# Altium schematic sheet Схема модуля АЦП.SchDoc
size 420 x 297 mm; Address1: Address1; Address2: Address2; Address3: Address3; Address4: Address4; DocumentNumber: АБВГ.123456.001 Э3; SheetNumber: 1; Scale: 1:1; DocumentType: Схема электрическая принципиальная; FirstReferrence: АБВГ.123456.001
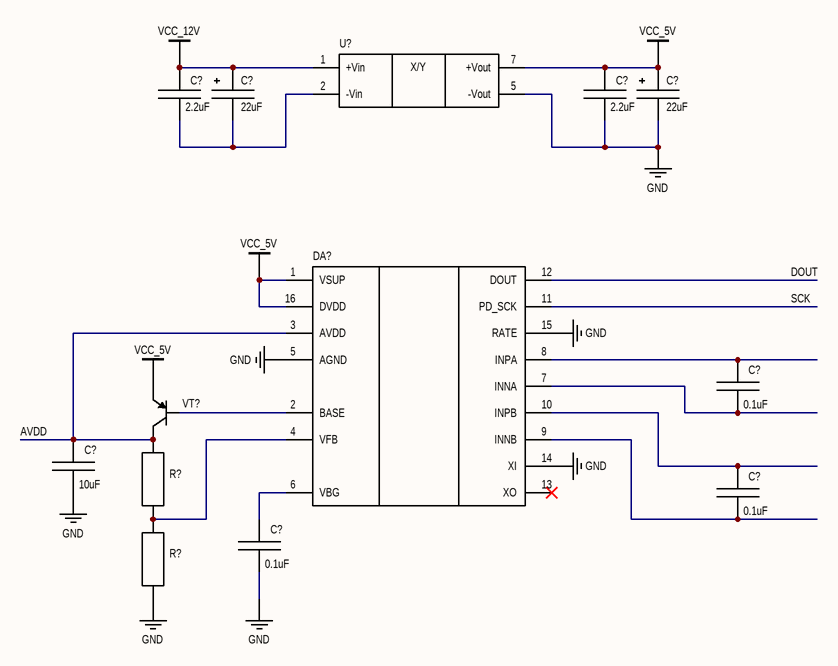
[diagram p0: Схема модуля АЦП.SchDoc]

## Parts
(Parts that share a designator on the sheet are numbered #1, #2 ... from top to bottom, then left to right.)
C?#1  2.2uF  [CH0201C]
C?#2  22uF  [D4C5.1H6]
C?#3  2.2uF  [CH0201C]
C?#4  22uF  [D4C5.1H6]
C?#5  0.1uF  [CH0805C]
C?#6  10uF  [CH1206C]
C?#7  0.1uF  [CH0805C]
C?#8  0.1uF  [CH0805C]
DA?  HX711  [16-SOP]  (value not drawn)
R?#1  *  [CH0603R]  (value not drawn)
R?#2  *  [CH0603R]  (value not drawn)
U?  TMV 1205S  [TMV-1205S]  (value not drawn)
VT?  MMSS8550-L-TP  [SOT23_132]  (value not drawn)

## Nets
GND: C?#3.2 C?#4.2 C?#6.2 C?#8.2 DA?.5(AGND) DA?.14(XI) DA?.15(RATE) R?#2.1 U?.5(-Vout)
VCC_5V: C?#3.1 C?#4.1 DA?.1(VSUP) DA?.16(DVDD) U?.7(+Vout) VT?.2(E)
VCC_12V: C?#1.1 C?#2.1 U?.1(+Vin)
AVDD: C?#6.1 DA?.3(AVDD) R?#1.2 VT?.3(C)
DOUT: DA?.12(DOUT)
SCK: DA?.11(PD_SCK)
NetC?#1_2: C?#1.2 C?#2.2 U?.2(-Vin)
NetC?#5_1: C?#5.1 DA?.8(INPA)
NetC?#5_2: C?#5.2 DA?.7(INNA)
NetC?#7_1: C?#7.1 DA?.10(INPB)
NetC?#7_2: C?#7.2 DA?.9(INNB)
NetC?#8_1: C?#8.1 DA?.6(VBG)
NetDA?_2: DA?.2(BASE) VT?.1(B)
NetDA?_4: DA?.4(VFB) R?#1.1 R?#2.2

Not connected (* = marked no-connect by the designer): DA? 13(XO)*

## Notes on the sheet
- Подп. и дата
- Инв. № дубл.
- Взам. инв. №
- Инв. № подл.
- Изм.
- Лист
- № докум.
- Подп.
- Дата
- 2.106-A3
- Копировал
- Формат А3
- (in symbol TMV 1205S) X/Y

## Library data of the parts
C?#1 C?#3 = Capacitor: Manufacturer: Samsung Electro-Mechanics; Model: CL31B225KOHNNNE; HelpURL: https://www.digikey.com/en/products/detail/samsung-electro-mechanics/CL31B225KOHNNNE/3886922; ComponentKind: 1206 (3216 Metric); Value: 2.2uF; Supplier 1: Avnet; Supplier Part Number 1: CL31B225KOHNNNE
C?#2 C?#4 = AlumCap: Cap Aluminum Lytic 22uF 25V 20% (5 X 11mm) Radial 2mm 60mA 2000h 105C Bulk; Manufacturer: KEMET; Model: ESH226M025AC3AA; Dielectric Material: Aluminium; Leakage Current: 5.5uA; Life (Hours): 2000Hour; Dissipation Factor: 16%; Lead Diameter: 0.5mm; Lead Length: 20mm; HelpURL: https://www.digikey.com/en/products/detail/kemet/ESH226M025AC3AA/3082977; ComponentKind: *; Value: 22uF; Supplier 1: Digi-Key; Supplier Part Number 1: 399-6562-ND; Manufacturer Part Number: ESH226M025AC3AA; RoHS: Yes; Category: Aluminum Electrolytic Capacitors; Stock: 47373; Pricing: 1=0,20000, 10=0,13600, 50=0,08180, 100=0,06900, 500=0,04724, 1000=0,04179, 2500=0,03998, 5000=0,03634 (USD); Mount: Through Hole,PCB; Case/Package: Radial; Min Operating Temperature: -40°C; Max Operating Temperature: 105°C; Capacitance: 22uF; Tolerance: 20%; Ripple Current: 60mA; Termination: Radial; Voltage Rating (DC): 25V; Voltage Rating: 25V; Package Quantity: 10000; Packaging: Bulk; Voltage: 25V; Series: ESH; Diameter: 5mm; Length: 11mm; Height: 11mm; Lead Pitch: 2mm; Height - Seated (Max): 0.492inch; Radiation Hardening: No; REACH SVHC: No SVHC; RoHS Compliant: Yes; ComponentLink1URL: https://datasheet.ciiva.com/22627/1794402-22627018.pdf?src-supplier=Farnell; ComponentLink1Description: https://datasheet.ciiva.com/22627/1794402-22627018.pdf?src-supplier=Farnell
C?#5 C?#7 C?#8 = Capacitor: Surface Mount Ceramic Multilayer Capacitor 0.1uF 5% X7R 16V 0805 Paper T/R; Manufacturer: YAGEO; Model: CC0805JRX7R7BB104; Capacitance: 100nF; HelpURL: https://www.digikey.com/en/products/detail/yageo/CC0805JRX7R7BB104/5884101; ComponentKind: 0805 (2012 Metric); Value: 0.1uF; Supplier 1: Digi-Key; Supplier Part Number 1: 311-4266-1-ND; Manufacturer Part Number: CC0805JRX7R7BB104; RoHS: Yes; Category: Ceramic Capacitors; Stock: 24921; Pricing: 1=0,12000, 10=0,08400, 50=0,04760, 100=0,03950, 500=0,02768, 1000=0,02291 (USD); Mount: Surface Mount; Case/Package: 0805; Case Code (Imperial): 0805; Case Code (Metric): 2012; Weight: 0.000194oz; Min Operating Temperature: -55°C; Max Operating Temperature: 125°C; Tolerance: 5%; Packaging: Tape and Reel; Voltage Rating (DC): 16V; Voltage Rating: 16V; Dielectric: X7R; Termination: SMD/SMT; Resistor Type: Ceramic; Series: CC; Length: 2mm; Width: 0.049inch; Thickness: 0.037inch; Depth: 1.25mm; Radiation Hardening: No; Lead Free: Lead Free; Halogen Free: Halogen Free; RoHS Compliant: Yes; ComponentLink1URL: https://datasheet.ciiva.com/26918/getdatasheetpartid-755584-26918332.pdf?src-supplier=Verical; ComponentLink1Description: https://datasheet.ciiva.com/26918/getdatasheetpartid-755584-26918332.pdf?src-supplier=Verical
C?#6 = Capacitor: Cap Ceramic 10uF 16V X7R 20% SMD 1206 125°C Embossed T/R; Manufacturer: Samsung Electro-Mechanics; Model: CL31B106MOHNNNE; HelpURL: https://www.digikey.com/en/products/detail/samsung-electro-mechanics/CL31B106MOHNNNE/5961125; ComponentKind: 1206 (3216 Metric); Value: 10uF; Supplier 1: Digi-Key; Supplier Part Number 1: 1276-6641-1-ND; Manufacturer Part Number: CL31B106MOHNNNE; RoHS: Yes; Category: Ceramic Capacitors; Stock: 1126; Pricing: 1=0,22000, 10=0,15000, 50=0,09000, 100=0,07600, 500=0,05202, 1000=0,04602 (USD); Mount: Surface Mount; Case/Package: 1206; Case Code (Metric): 3216; Case Code (Imperial): 1206; Min Operating Temperature: -55°C; Max Operating Temperature: 125°C; Capacitance: 10uF; Tolerance: 20%; Dielectric: X7R; Voltage Rating (DC): 16V; Packaging: Tape and Reel; Voltage Rating: 16V; Length: 0.126inch; Width: 0.063inch; Thickness: 0.071inch; RoHS Compliant: Yes; ComponentLink1URL: http://www.samsungsem.com/kr/support/product-search/mlcc/CL31B106MOHNNNE.jsp?src-supplier=Digi-Key; ComponentLink1Description: http://www.samsungsem.com/kr/support/product-search/mlcc/CL31B106MOHNNNE.jsp?src-supplier=Digi-Key
DA? = HX711: ADC for Weigh Scales; Manufacturer: Avia Semiconductors; Model: HX711; ComponentKind: SMD
R?#1 R?#2 = Resistor: Manufacturer: *; Model: *; HelpURL: *; ComponentKind: *; Value: *
U? = TMV 1205S: DC/DC CONVERTER 5V 1W; Manufacturer: Traco Power; Model: TMV 1205S; HelpURL: https://www.digikey.com/en/products/detail/traco-power/TMV-1205S/9383532https://www.digikey.com/en/products/detail/traco-power/TMV-1205S/9383532; Supplier 1: RSComponents; Supplier Part Number 1: 6664032
VT? = PNP: Bipolar; Manufacturer: Micro Commercial Co; Model: MMSS8550-L-TP; ComponentKind: SOT-23; HelpURL: https://www.digikey.com/en/products/detail/micro-commercial-co/MMSS8550-L-TP/2827198; Supplier 1: Digi-Key; Supplier Part Number 1: MMSS8550-L-TPMSCT-ND